# EAGLE design Fake6500-1 (EAGLE 7.7.0)
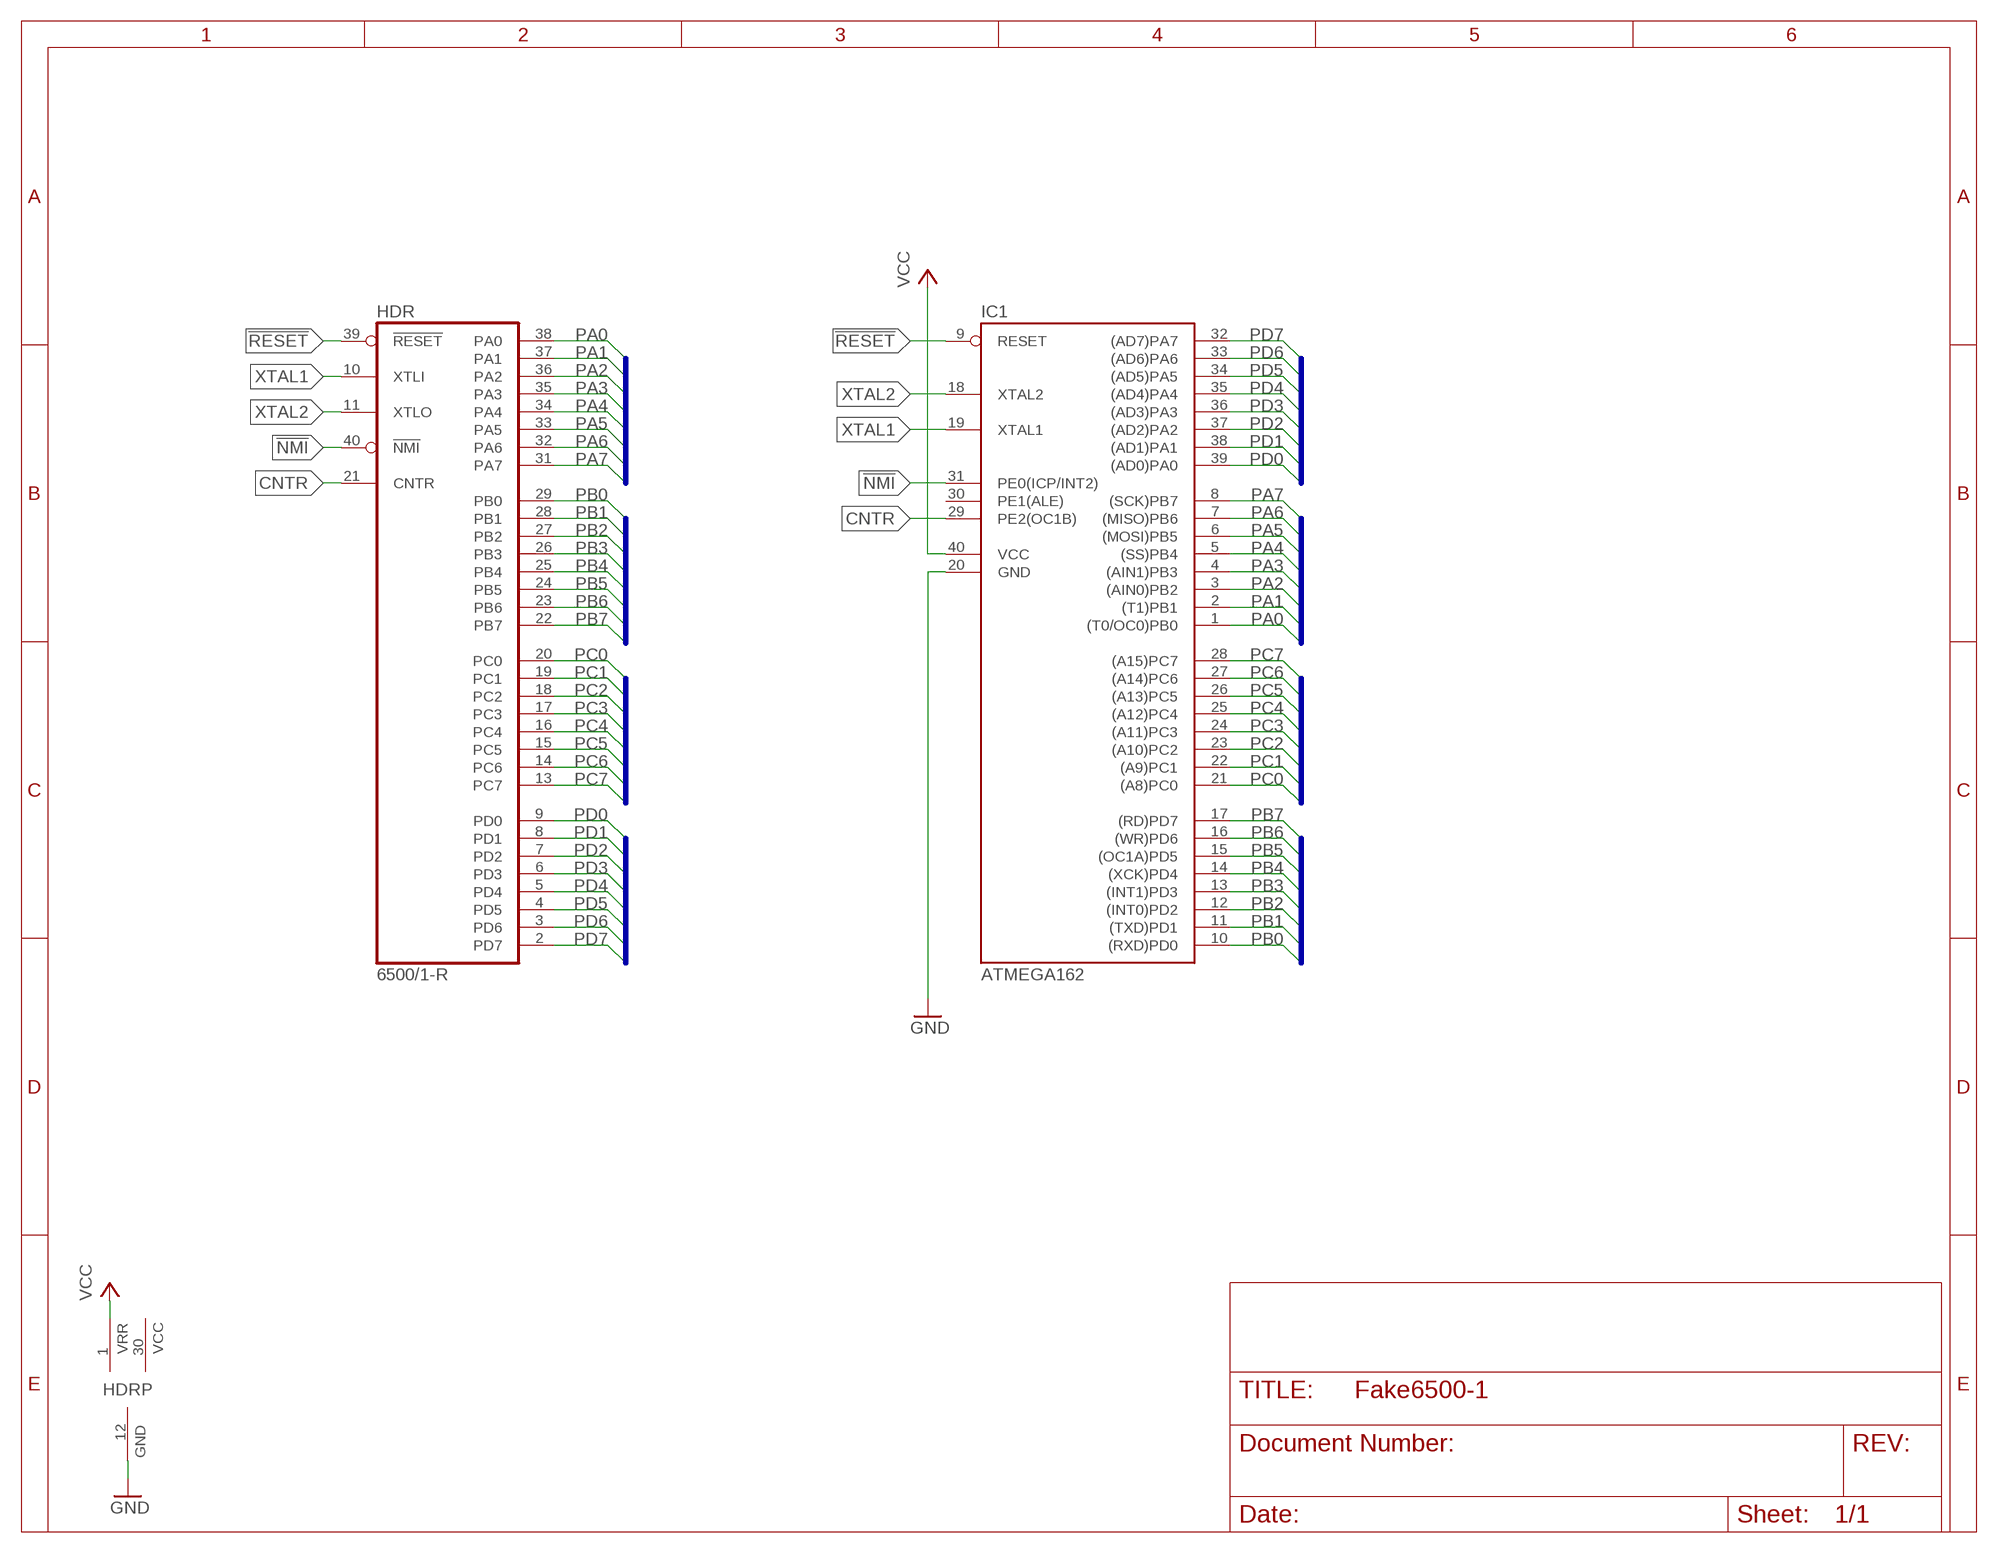
[diagram p0: schematic, sheet 1]

## Parts
HDR  6500/1-R  [DIL40-ROUNDPAD]
IC1  ATMEGA162  MEGA8515-PR  [DIL40-ROUNDPAD]

## Nets
!NMI: HDR.40(!NMI) IC1.31(PE0(ICP/INT2))
!RESET: HDR.39(!RESET) IC1.9(RESET)
CNTR: HDR.21(CNTR) IC1.29(PE2(OC1B))
GND: HDR.12(GND) IC1.20(GND)
PA0: HDR.38(PA0) IC1.1((T0/OC0)PB0)
PA1: HDR.37(PA1) IC1.2((T1)PB1)
PA2: HDR.36(PA2) IC1.3((AIN0)PB2)
PA3: HDR.35(PA3) IC1.4((AIN1)PB3)
PA4: HDR.34(PA4) IC1.5((SS)PB4)
PA5: HDR.33(PA5) IC1.6((MOSI)PB5)
PA6: HDR.32(PA6) IC1.7((MISO)PB6)
PA7: HDR.31(PA7) IC1.8((SCK)PB7)
PB0: HDR.29(PB0) IC1.10((RXD)PD0)
PB1: HDR.28(PB1) IC1.11((TXD)PD1)
PB2: HDR.27(PB2) IC1.12((INT0)PD2)
PB3: HDR.26(PB3) IC1.13((INT1)PD3)
PB4: HDR.25(PB4) IC1.14((XCK)PD4)
PB5: HDR.24(PB5) IC1.15((OC1A)PD5)
PB6: HDR.23(PB6) IC1.16((WR)PD6)
PB7: HDR.22(PB7) IC1.17((RD)PD7)
PC0: HDR.20(PC0) IC1.21((A8)PC0)
PC1: HDR.19(PC1) IC1.22((A9)PC1)
PC2: HDR.18(PC2) IC1.23((A10)PC2)
PC3: HDR.17(PC3) IC1.24((A11)PC3)
PC4: HDR.16(PC4) IC1.25((A12)PC4)
PC5: HDR.15(PC5) IC1.26((A13)PC5)
PC6: HDR.14(PC6) IC1.27((A14)PC6)
PC7: HDR.13(PC7) IC1.28((A15)PC7)
PD0: HDR.9(PD0) IC1.39((AD0)PA0)
PD1: HDR.8(PD1) IC1.38((AD1)PA1)
PD2: HDR.7(PD2) IC1.37((AD2)PA2)
PD3: HDR.6(PD3) IC1.36((AD3)PA3)
PD4: HDR.5(PD4) IC1.35((AD4)PA4)
PD5: HDR.4(PD5) IC1.34((AD5)PA5)
PD6: HDR.3(PD6) IC1.33((AD6)PA6)
PD7: HDR.2(PD7) IC1.32((AD7)PA7)
VCC: HDR.1(VRR) IC1.40(VCC)
XTAL1: HDR.10(XTLI) IC1.19(XTAL1)
XTAL2: HDR.11(XTLO) IC1.18(XTAL2)
Unconnected: IC1.30(PE1(ALE))

## Buses
PA[0..7]
PB[0..7]
PC[0..7]
PD[0..7]

## Power pins joined to a net without a drawn wire
VCC: HDR.30(VCC)

## Library data of the parts
HDR = commodore:6500/1
IC1 = atmel:MEGA8515-P: MICROCONTROLLER 8 Kbytes FLASH 512 bytes SRAM 512 bytes EEPROM USART 8-channel 10 bit ADC Source: avr.lbr

## Board
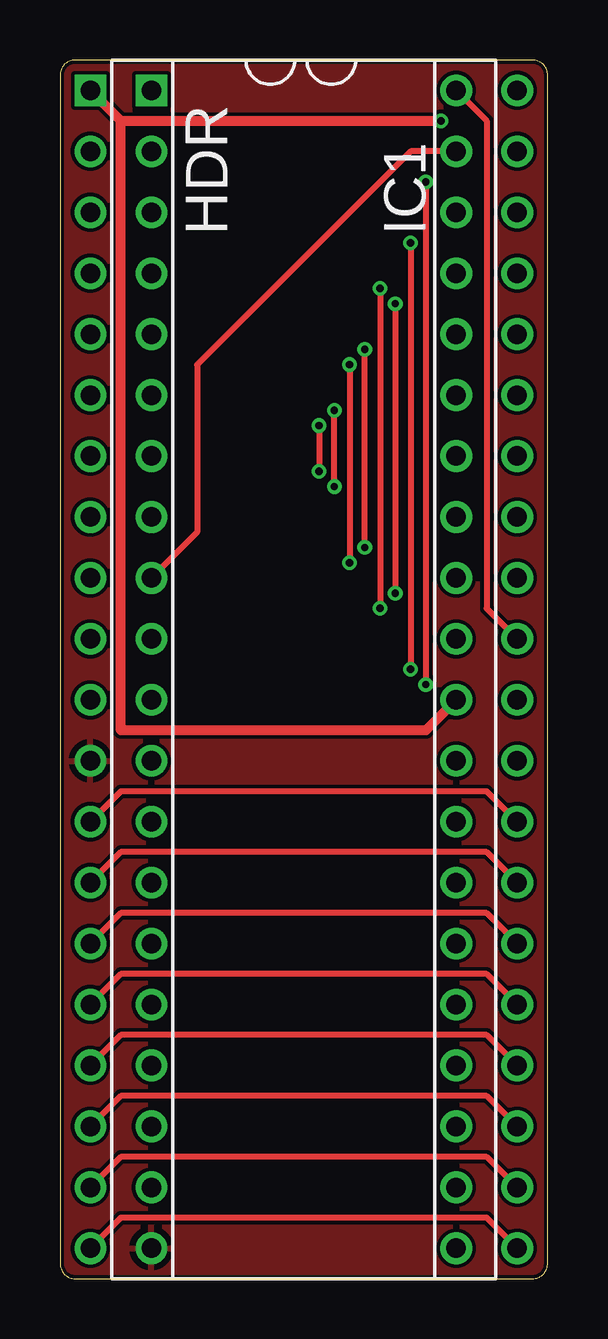
[diagram p1: board, top side]
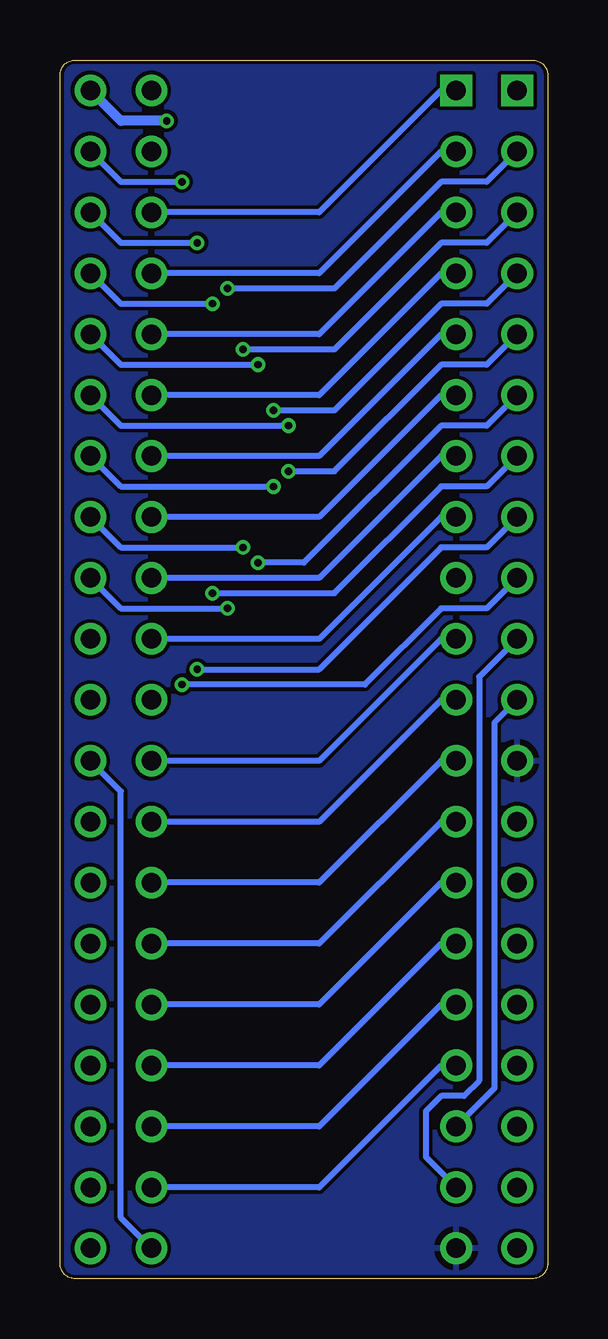
[diagram p2: board, bottom side, seen from below]

Size 20.32 x 50.8 mm. Coordinates in mm from the lower left corner, seen from the top.
Outline: 0,50.16 0,0.64 arc90 0.64,0 19.68,0 arc90 20.32,0.64 20.32,50.16 arc90 19.68,50.8 0.64,50.8 arc90 0,50.16
Copper layers (1*16): Top 0.035mm / dielectric 1.5mm / Bottom 0.035mm
Design rules "hackvana": minimum track width 6mil, minimum drill 0.3mm, track to track 6mil, track to pad 6mil, pad to pad 6mil, via to via 6mil, smd to smd 0mil, copper to edge 6mil, drill to drill 6mil, minimum pad ring 10mil, minimum via ring 6mil, stop-mask expansion 2mil, vias tented up to drill 100mil, thermal gap 10mil

### Footprints (pad centres in the part's own frame; a part is rotated, then mirrored left to right if it is on the bottom)
DIL40-ROUNDPAD = drill 0.813 square: 1 -24.13,-7.62 | drill 0.813: 2 -21.59,-7.62; 3 -19.05,-7.62; 4 -16.51,-7.62; 5 -13.97,-7.62; 6 -11.43,-7.62; 7 -8.89,-7.62; 8 -6.35,-7.62; 9 -3.81,-7.62; 10 -1.27,-7.62; 11 1.27,-7.62; 12 3.81,-7.62; 13 6.35,-7.62; 14 8.89,-7.62; 15 11.43,-7.62; 16 13.97,-7.62; 17 16.51,-7.62; 18 19.05,-7.62; 19 21.59,-7.62; 20 24.13,-7.62; 21 24.13,7.62; 22 21.59,7.62; 23 19.05,7.62; 24 16.51,7.62; 25 13.97,7.62; 26 11.43,7.62; 27 8.89,7.62; 28 6.35,7.62; 29 3.81,7.62; 30 1.27,7.62; 31 -1.27,7.62; 32 -3.81,7.62; 33 -6.35,7.62; 34 -8.89,7.62; 35 -11.43,7.62; 36 -13.97,7.62; 37 -16.51,7.62; 38 -19.05,7.62; 39 -21.59,7.62; 40 -24.13,7.62

### Placement (x,y rotation side)
HDR  8.89,25.4 270 top
IC1  11.43,25.4 270 top

### Tracks (layer width: path | path; a pad name or v marks a point on that pad's centre or on a via)
!NMI
  Top 0.254: HDR.40 17.78,48.26 17.78,27.94 IC1.31
!RESET
  Top 0.254: HDR.39 14.61,46.99 5.71,38.1 5.71,31.11 IC1.9
CNTR
  Bottom 0.254: HDR.21 17.78,2.54 17.78,20.32 IC1.29
GND
  pour Top: 0.64,0 19.68,0 arc90 20.32,0.64 20.32,50.16 arc90 19.68,50.8 0.64,50.8 arc90 0,50.16 0,0.64 arc90
  pour Bottom: 0.64,0 19.68,0 arc90 20.32,0.64 20.32,50.16 arc90 19.68,50.8 0.64,50.8 arc90 0,50.16 0,0.64 arc90
PA0
  Bottom 0.254: IC1.1 4.45,49.53 9.53,44.45 HDR.38
PA1
  Bottom 0.254: IC1.2 4.45,46.99 9.53,41.91 HDR.37
PA2
  Bottom 0.254: IC1.3 4.45,44.45 9.53,39.37 HDR.36
PA3
  Bottom 0.254: IC1.4 4.45,41.91 9.53,36.83 HDR.35
PA4
  Bottom 0.254: IC1.5 4.45,39.37 9.53,34.29 HDR.34
PA5
  Bottom 0.254: IC1.6 4.45,36.83 9.53,31.75 HDR.33
PA6
  Bottom 0.254: IC1.7 4.45,34.29 9.53,29.21 HDR.32
PA7
  Bottom 0.254: IC1.8 4.45,31.75 9.53,26.67 HDR.31
PB0
  Bottom 0.254: IC1.10 4.45,26.67 9.53,21.59 HDR.29
PB1
  Bottom 0.254: IC1.11 4.45,24.13 9.53,19.05 HDR.28
PB2
  Bottom 0.254: IC1.12 4.45,21.59 9.53,16.51 HDR.27
PB3
  Bottom 0.254: IC1.13 4.45,19.05 9.53,13.97 HDR.26
PB4
  Bottom 0.254: IC1.14 4.45,16.51 9.53,11.43 HDR.25
PB5
  Bottom 0.254: IC1.15 4.45,13.97 9.53,8.89 HDR.24
PB6
  Bottom 0.254: IC1.16 4.45,11.43 9.53,6.35 HDR.23
PB7
  Bottom 0.254: IC1.17 4.45,8.89 9.53,3.81 HDR.22
PC0
  Top 0.254: IC1.21 17.78,2.54 2.54,2.54 HDR.20
PC1
  Top 0.254: IC1.22 17.78,5.08 2.54,5.08 HDR.19
PC2
  Top 0.254: IC1.23 17.78,7.62 2.54,7.62 HDR.18
PC3
  Top 0.254: IC1.24 17.78,10.16 2.54,10.16 HDR.17
PC4
  Top 0.254: IC1.25 17.78,12.7 2.54,12.7 HDR.16
PC5
  Top 0.254: IC1.26 17.78,15.24 2.54,15.24 HDR.15
PC6
  Top 0.254: IC1.27 17.78,17.78 2.54,17.78 HDR.14
PC7
  Top 0.254: IC1.28 17.78,20.32 2.54,20.32 HDR.13
PD0  (via drill 0.3)
  Top 0.254: v15.24,45.72 v15.24,24.77
  Bottom 0.254: IC1.39 17.78,45.72 v15.24,45.72 | HDR.9 2.54,27.94 4.45,27.94 7.62,24.77 v15.24,24.77
PD1  (via drill 0.3)
  Top 0.254: v14.61,43.18 v14.61,25.4
  Bottom 0.254: IC1.38 17.78,43.18 v14.61,43.18 | HDR.8 2.54,30.48 4.45,30.48 9.53,25.4 v14.61,25.4
PD2  (via drill 0.3)
  Top 0.254: v13.97,40.64 v13.97,28.57
  Bottom 0.254: IC1.37 17.78,40.64 v13.97,40.64 | HDR.7 2.54,33.02 4.45,33.02 8.89,28.57 v13.97,28.57
PD3  (via drill 0.3)
  Top 0.254: v12.06,38.1 v12.06,29.84
  Bottom 0.254: IC1.36 17.78,38.1 v12.06,38.1 | HDR.6 2.54,35.56 4.45,35.56 10.16,29.84 v12.06,29.84
PD4  (via drill 0.3)
  Top 0.254: v10.79,35.56 v10.79,33.66
  Bottom 0.254: HDR.5 2.54,38.1 4.45,38.1 8.89,33.66 v10.79,33.66 | IC1.35 17.78,35.56 v10.79,35.56
PD5  (via drill 0.3)
  Top 0.254: v11.43,33.02 v11.43,36.2
  Bottom 0.254: HDR.4 2.54,40.64 4.45,40.64 8.89,36.2 v11.43,36.2 | IC1.34 17.78,33.02 v11.43,33.02
PD6  (via drill 0.3)
  Top 0.254: v12.7,30.48 v12.7,38.73
  Bottom 0.254: HDR.3 2.54,43.18 4.45,43.18 8.89,38.73 v12.7,38.73 | IC1.33 17.78,30.48 v12.7,30.48
PD7  (via drill 0.3)
  Top 0.254: v13.34,41.27 v13.34,27.94
  Bottom 0.254: HDR.2 2.54,45.72 4.45,45.72 8.89,41.27 v13.34,41.27 | IC1.32 17.78,27.94 v13.34,27.94
VCC  (via drill 0.3)
  Top 0.406: HDR.1 2.54,48.26 | 2.54,48.26 v15.88,48.26 | HDR.30 15.24,22.86 2.54,22.86 2.54,48.26
  Bottom 0.406: v15.88,48.26 17.78,48.26 IC1.40
XTAL1
  Bottom 0.254: HDR.10 2.86,25.08 2.86,8.26 3.49,7.62 4.45,7.62 5.08,6.99 5.08,5.08 IC1.19
XTAL2
  Bottom 0.254: HDR.11 2.22,23.18 2.22,7.94 IC1.18